# Altium schematic sheet FPC-isoIOs-Power_Protection_AP22653.SchDoc
size A4; SheetNumber: 9; SheetTotal: 15
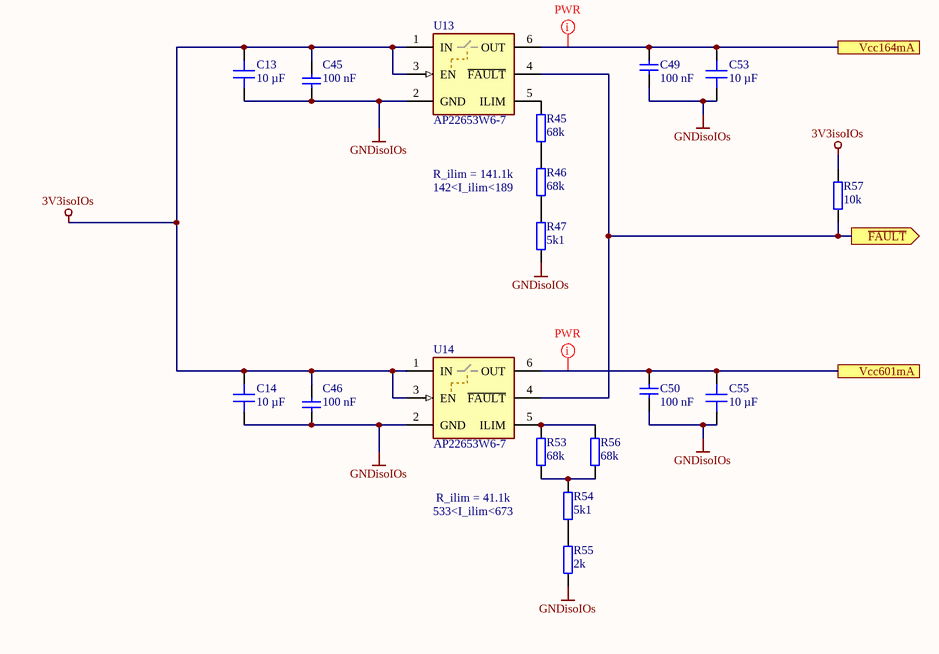
[diagram p0: FPC-isoIOs-Power_Protection_AP22653.SchDoc]

## Parts
C13  10 µF  [C_0603_TE]
C14  10 µF  [C_0603_TE]
C45  100 nF  [C_0603_TE]
C46  100 nF  [C_0603_TE]
C49  100 nF  [C_0603_TE]
C50  100 nF  [C_0603_TE]
C53  10 µF  [C_0603_TE]
C55  10 µF  [C_0603_TE]
R45  68k  [R_0603_TE]
R46  68k  [R_0603_TE]
R47  5k1  [R_0603_TE]
R53  68k  [R_0603_TE]
R54  5k1  [R_0603_TE]
R55  2k  [R_0603_TE]
R56  68k  [R_0603_TE]
R57  10k  [R_0603_TE]
U13  AP22653W6-7  [TSOT26-6]
U14  AP22653W6-7  [TSOT26-6]

## Ports
Vcc164mA, Vcc601mA, ~{FAULT} (out)

## Nets
3V3isoIOs: C13.2 C14.2 C45.1 C46.1 R57.2 U13.1(IN) U13.3(EN) U14.1(IN) U14.3(EN)
GNDisoIOs: C13.1 C14.1 C45.2 C46.2 C49.2 C50.2 C53.1 C55.1 R47.1 R55.1 U13.2(GND) U14.2(GND)
~{FAULT}: R57.1 U13.4(~{FAULT}) U14.4(~{FAULT}) ; port ~{FAULT}
Vcc164mA: C49.1 C53.2 U13.6(OUT) ; port Vcc164mA
Vcc601mA: C50.1 C55.2 U14.6(OUT) ; port Vcc601mA
NetR45_1: R45.1 R46.2
NetR45_2: R45.2 U13.5(ILIM)
NetR46_1: R46.1 R47.2
NetR53_1: R53.1 R54.2 R56.1
NetR53_2: R53.2 R56.2 U14.5(ILIM)
NetR54_1: R54.1 R55.2

## Layout directives
net class PWR: Vcc164mA, Vcc601mA

## Notes on the sheet
- R_ilim = 141.1k
- 142<I_ilim<189
- R_ilim = 41.1k
- 533<I_ilim<673
- Title
- Revision:
- Design Engineer:
- Date:
- Project:
- Sheet
- of

## Library data of the parts
C13 C14 C53 C55 = CL10A106MO8NQNC: Capacitor 0603, 16 VDC, 10 µF, X5R; Manufacturer: Samsung Electro-Mechanics; Tolerance: 20 %; Voltage Rating: 16 VDC; Created from: AGeiger; Manufacturer Part Number: CL10A106MO8NQNC; PartID: 101; Created On: 22/08/2022 13:56:44; ComponentLink1Description: Datasheet; ComponentLink1URL: https://datasheet.lcsc.com/lcsc/1810261909_Samsung-Electro-Mechanics-CL10A106MO8NQNC_C92487.pdf; Component Type: Capacitor 0603; Device Package: 0603; Last Updated: 19/11/2024 12:40:46; Mounting Type: SMD; Operating Temperature: -55 - 85°C; Series: X5R; Supplier 1: LCSC; Supplier Part Number 1: C92487; Type: Capacitor; Value: 10 µF; Live Cycle Status: 1; LCSC Part Number: C92487
C45 C46 C49 C50 = UZgen_C_0603_100nF_50V_X7R: Generic capacitor; Manufacturer: UZgen; Voltage: 50V; Tolerance: 10 %; Created from: AGeiger; Manufacturer Part Number: UZgen_C_0603_100nF_50V_X7R; PartID: 1; Created On: 02/07/2024 14:42:23; Value: 100 nF; Device Package: 0603; Technology: X7R; Mounting Type: SMD; Last Updated: 08/08/2024 15:01:15
R45 R46 R53 R56 = UZgen_R_0603_68k: Generic resistor; Manufacturer: UZgen; Tolerance: 1 %; Created from: UZgenTool; Manufacturer Part Number: UZgen_R_0603_68k; PartID: 264; Created On: 02/07/2024 17:29:50; Value: 68k; Device Package: 0603; Mounting Type: SMD; Last Updated: 02/07/2024 17:29:50
R47 R54 = UZgen_R_0603_5k1: Generic resistor; Manufacturer: UZgen; Tolerance: 1 %; Created from: UZgenTool; Manufacturer Part Number: UZgen_R_0603_5k1; PartID: 238; Created On: 02/07/2024 17:29:50; Value: 5k1; Device Package: 0603; Mounting Type: SMD; Last Updated: 02/07/2024 17:29:50
R55 = UZgen_R_0603_2k: Generic resistor; Manufacturer: UZgen; Tolerance: 1 %; Created from: UZgenTool; Manufacturer Part Number: UZgen_R_0603_2k; PartID: 228; Created On: 02/07/2024 17:29:49; Value: 2k; Device Package: 0603; Mounting Type: SMD; Last Updated: 02/07/2024 17:29:49
R57 = UZgen_R_0603_10k: Generic resistor; Manufacturer: UZgen; Tolerance: 1 %; Created from: AGeiger; Manufacturer Part Number: UZgen_R_0603_10k; PartID: 1; Created On: 02/07/2024 14:34:53; Value: 10k; Device Package: 0603; Mounting Type: SMD; Last Updated: 02/07/2024 14:37:16
U13 U14 = AP22653W6-7: Precision Adjustable Current-limited Power Switch; Manufacturer: Diodes Incorporated; Created from: MGeier; Manufacturer Part Number: AP22653W6-7; PartID: 10; Created On: 10/04/2025 19:40:00; ComponentLink1Description: Datasheet; ComponentLink1URL: https://www.diodes.com/datasheet/download/AP22652_AP22653_AP22652A_AP22653A.pdf; ComponentLink2Description: Homepage; ComponentLink2URL: https://www.diodes.com/part/view/AP22653; Component Type: Power Switch ICs; Device Package: SOT26; Last Updated: 11/04/2025 15:13:45; Mounting Type: SMD; Operating Temperature: -40 to +125 °C; Series: AP22652/AP22653/AP22652A/AP22653A; Supplier 1: LCSC; Supplier Part Number 1: C2158037; Value: AP22653W6-7; LCSC Part Number: C2158037